# Altium schematic sheet BANK1.SchDoc
size A4
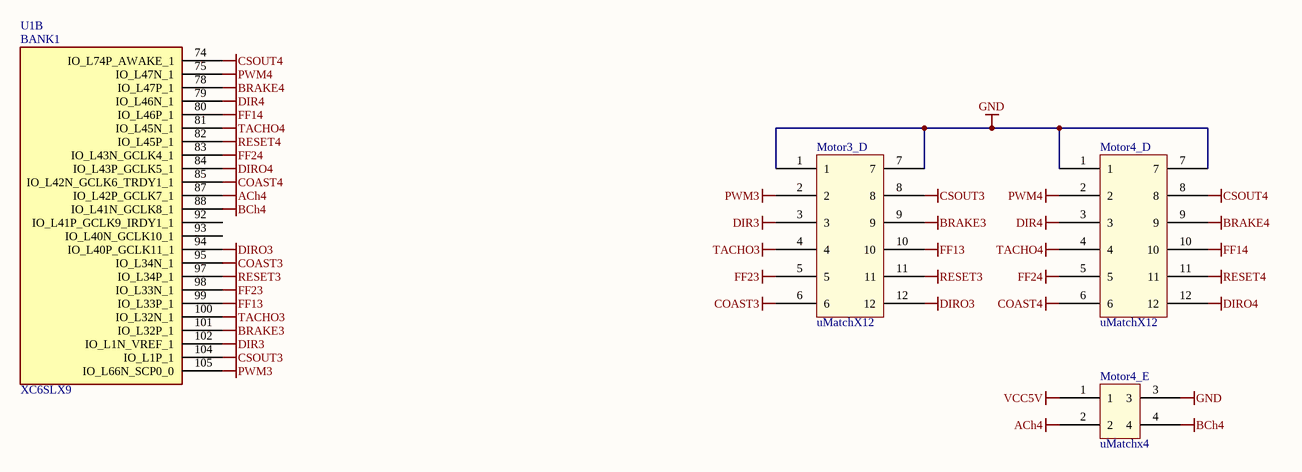
[diagram p0: BANK1.SchDoc]

## Parts
Motor3_D  uMatchX12  [uMatchX12]
Motor4_D  uMatchX12  [uMatchX12]
Motor4_E  uMatchx4  [Micromatch x4]
U1  XC6SLX9  [XC6SLX9]  (part B of 6)

## Nets
ACh4: Motor4_E.2 U1.87(IO_L42P_GCLK7_1)
BCh4: Motor4_E.4 U1.88(IO_L41N_GCLK8_1)
BRAKE3: Motor3_D.9 U1.101(IO_L32P_1)
BRAKE4: Motor4_D.9 U1.78(IO_L47P_1)
COAST3: Motor3_D.6 U1.95(IO_L34N_1)
COAST4: Motor4_D.6 U1.85(IO_L42N_GCLK6_TRDY1_1)
CSOUT3: Motor3_D.8 U1.104(IO_L1P_1)
CSOUT4: Motor4_D.8 U1.74(IO_L74P_AWAKE_1)
DIR3: Motor3_D.3 U1.102(IO_L1N_VREF_1)
DIR4: Motor4_D.3 U1.79(IO_L46N_1)
DIRO3: Motor3_D.12 U1.94(IO_L40P_GCLK11_1)
DIRO4: Motor4_D.12 U1.84(IO_L43P_GCLK5_1)
FF13: Motor3_D.10 U1.99(IO_L33P_1)
FF14: Motor4_D.10 U1.80(IO_L46P_1)
FF23: Motor3_D.5 U1.98(IO_L33N_1)
FF24: Motor4_D.5 U1.83(IO_L43N_GCLK4_1)
GND: Motor3_D.1 Motor3_D.7 Motor4_D.1 Motor4_D.7 Motor4_E.3
PWM3: Motor3_D.2 U1.105(IO_L66N_SCP0_0)
PWM4: Motor4_D.2 U1.75(IO_L47N_1)
RESET3: Motor3_D.11 U1.97(IO_L34P_1)
RESET4: Motor4_D.11 U1.82(IO_L45P_1)
TACHO3: Motor3_D.4 U1.100(IO_L32N_1)
TACHO4: Motor4_D.4 U1.81(IO_L45N_1)
VCC5V: Motor4_E.1

Not connected (* = marked no-connect by the designer): U1 92(IO_L41P_GCLK9_IRDY1_1) 93(IO_L40N_GCLK10_1)

## Notes on the sheet
- (in symbol C6SLX9, part B) BANK1

## Library data of the parts
U1 = C6SLX9: Imported